# Altium schematic sheet AUDIO.SchDoc
size 558 x 431 mm
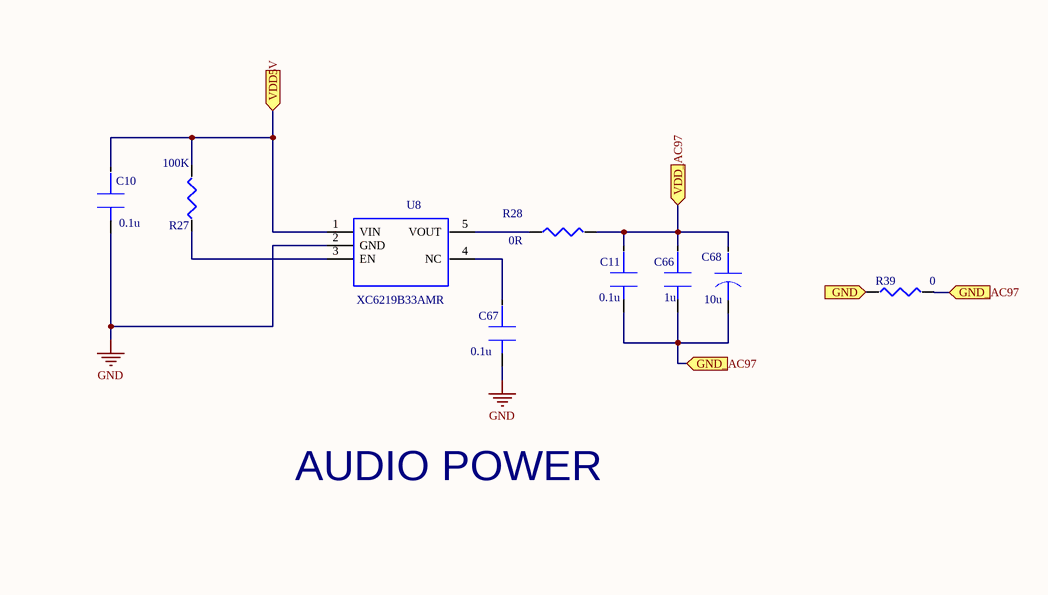
[diagram p0: AUDIO.SchDoc, top left]
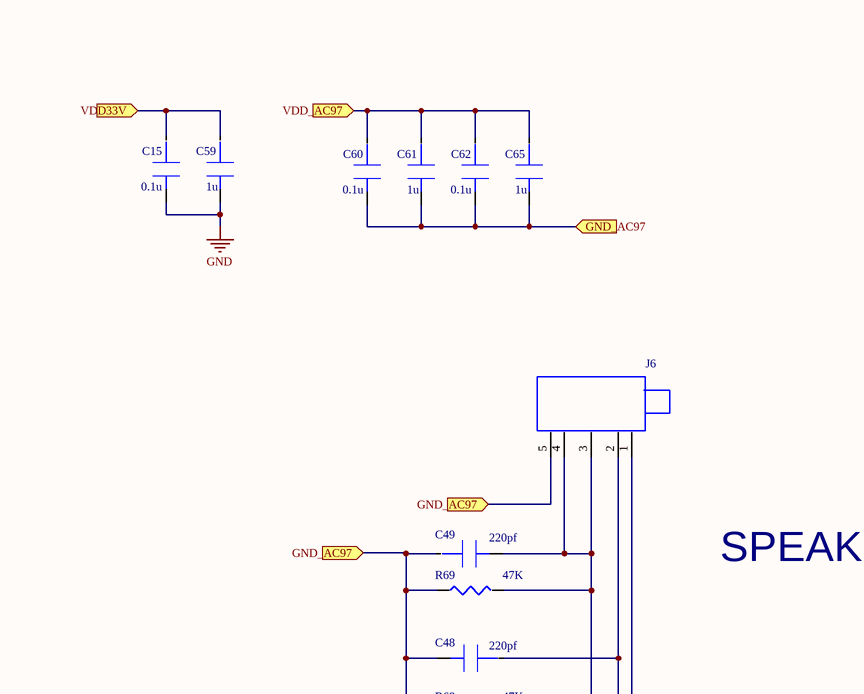
[diagram p1: AUDIO.SchDoc, top right]
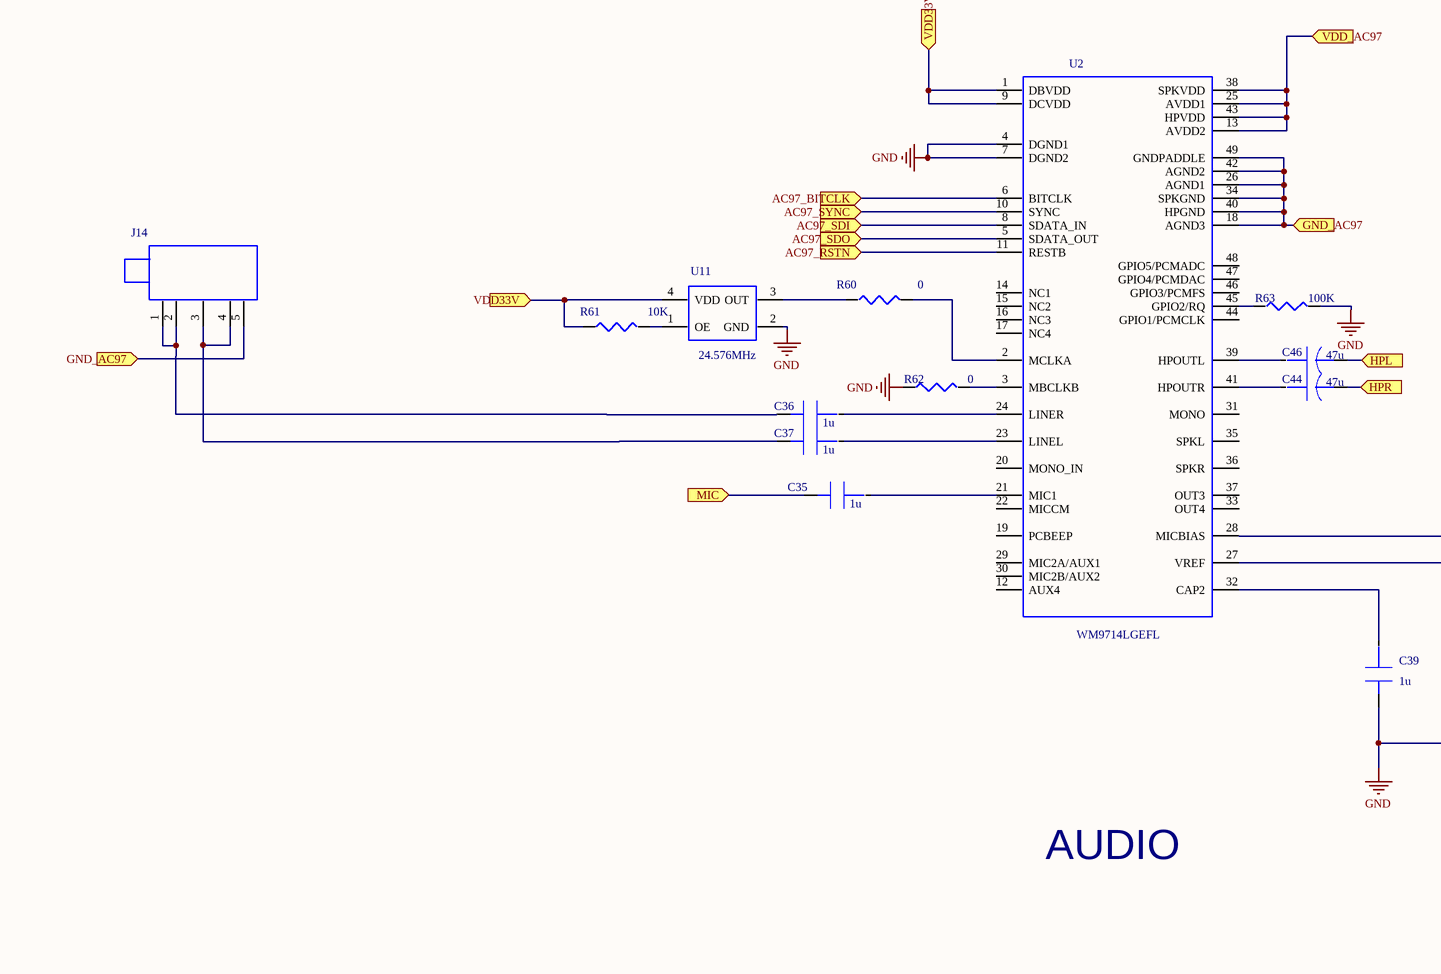
[diagram p2: AUDIO.SchDoc, bottom left]
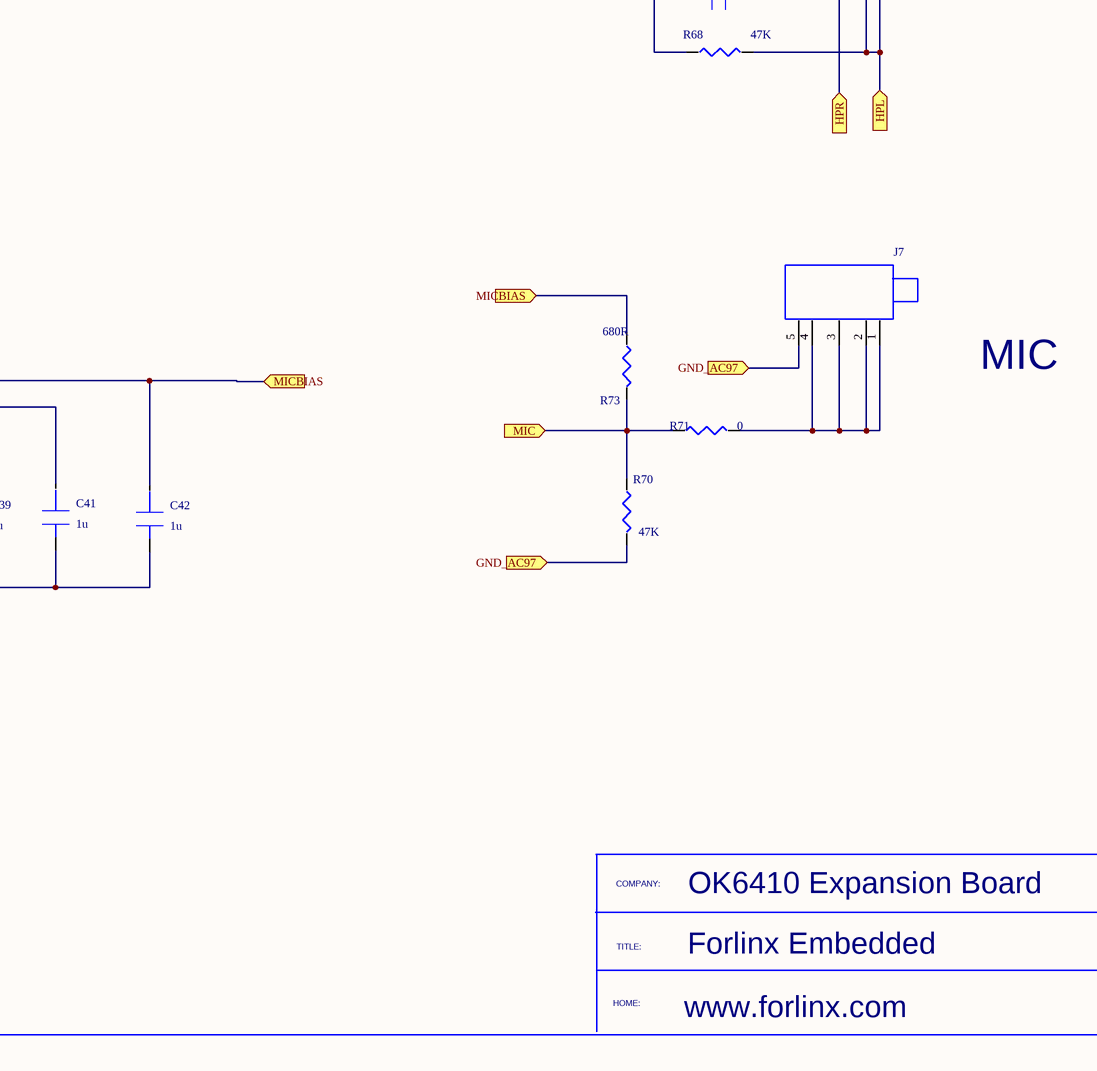
[diagram p3: AUDIO.SchDoc, bottom right]

## Parts
C10  value 0.1u  (hidden comment: CAP1206)
C11  value 0.1u  (hidden comment: CAP1206)
C15  value 0.1u  (hidden comment: CAP1206)
C35  value 1u  (hidden comment: CAP1206)
C36  value 1u  (hidden comment: CAP1206)
C37  value 1u  (hidden comment: CAP1206)
C39  value 1u  (hidden comment: CAP1206)
C41  value 1u  (hidden comment: CAP1206)
C42  value 1u  (hidden comment: CAP1206)
C44  value 47u  (hidden comment: CAP-AE4)
C46  value 47u  (hidden comment: CAP-AE4)
C48  value 220pf  (hidden comment: CAP1206)
C49  value 220pf  (hidden comment: CAP1206)
C59  value 1u  (hidden comment: CAP1206)
C60  value 0.1u  (hidden comment: CAP1206)
C61  value 1u  (hidden comment: CAP1206)
C62  value 0.1u  (hidden comment: CAP1206)
C65  value 1u  (hidden comment: CAP1206)
C66  value 1u  (hidden comment: CAP1206)
C67  value 0.1u  (hidden comment: CAP1206)
C68  value 10u  (hidden comment: CAP-AE4)
J6  MIC_SPEAKER  (value not drawn)
J7  MIC_SPEAKER  (value not drawn)
J14  MIC_SPEAKER  (value not drawn)
R27  value 100K  (hidden comment: R_0)
R28  value 0R  (hidden comment: R_0)
R39  value 0  (hidden comment: R)
R60  value 0  (hidden comment: R)
R61  value 10K  (hidden comment: R)
R62  value 0  (hidden comment: R)
R63  value 100K  (hidden comment: R)
R68  value 47K  (hidden comment: R)
R69  value 47K  (hidden comment: R)
R70  value 47K  (hidden comment: R)
R71  value 0  (hidden comment: R)
R73  value 680R  (hidden comment: R)
U2  WM9714LGEFL
U8  XC6219B33AMR
U11  value 24.576MHz  (hidden comment: Y7050)

## Ports
AC97_BITCLK, AC97_RSTN, AC97_SDI, AC97_SDO, AC97_SYNC, GND, GND_AC97, HPL, HPR, MIC, MICBIAS, VDD5V, VDD33V, VDD_AC97

## Nets
GND: C10.2 C15.2 C39.2 C41.2 C42.2 C59.2 C67.2 R62.1 R63.2 U2.4(DGND1) U2.7(DGND2) U8.2(GND) U11.2(GND)
AC97_BITCLK: U2.6(BITCLK) ; port AC97_BITCLK
AC97_RSTN: U2.11(RESTB) ; port AC97_RSTN
AC97_SDI: U2.8(SDATA_IN) ; port AC97_SDI
AC97_SDO: U2.5(SDATA_OUT) ; port AC97_SDO
AC97_SYNC: U2.10(SYNC) ; port AC97_SYNC
GND: R39.1 ; port GND  [a separate net that carries the same name]
GND_AC97: C11.2 C48.2 C49.1 C60.2 C61.2 C62.2 C65.2 C66.2 C68.2 J6.5 J7.5 J14.5 R39.2 R68.1 R69.1 R70.2 U2.18(AGND3) U2.26(AGND1) U2.34(SPKGND) U2.40(HPGND) U2.42(AGND2) U2.49(GNDPADDLE) ; port GND_AC97
HPL: C46.2 C48.1 J6.1 J6.2 R68.2 ; port HPL
HPR: C44.2 C49.2 J6.3 J6.4 R69.2 ; port HPR
MIC: C35.2 R70.1 R71.1 R73.2 ; port MIC
MICBIAS: C42.1 R73.1 U2.28(MICBIAS) ; port MICBIAS
VDD5V: C10.1 R27.1 U8.1(VIN) ; port VDD5V
VDD33V: C15.1 C59.1 R61.1 U2.1(DBVDD) U2.9(DCVDD) U11.4(VDD) ; port VDD33V
VDD_AC97: C11.1 C60.1 C61.1 C62.1 C65.1 C66.1 C68.1 R28.1 U2.13(AVDD2) U2.25(AVDD1) U2.38(SPKVDD) U2.43(HPVDD) ; port VDD_AC97
NetC35_1: C35.1 U2.21(MIC1)
NetC36_1: C36.1 U2.24(LINER)
NetC36_2: C36.2 J14.1 J14.2
NetC37_1: C37.1 U2.23(LINEL)
NetC37_2: C37.2 J14.3 J14.4
NetC39_1: C39.1 U2.32(CAP2)
NetC41_1: C41.1 U2.27(VREF)
NetC44_1: C44.1 U2.41(HPOUTR)
NetC46_1: C46.1 U2.39(HPOUTL)
NetC67_1: C67.1 U8.4(NC)
NetJ7_1: J7.1 J7.2 J7.3 J7.4 R71.2
NetR27_2: R27.2 U8.3(EN)
NetR28_2: R28.2 U8.5(VOUT)
NetR60_1: R60.1 U11.3(OUT)
NetR60_2: R60.2 U2.2(MCLKA)
NetR61_2: R61.2 U11.1(OE)
NetR62_2: R62.2 U2.3(MBCLKB)
NetR63_1: R63.1 U2.45(GPIO2/RQ)

Not connected (* = marked no-connect by the designer): U2 12(AUX4) 14(NC1) 15(NC2) 16(NC3) 17(NC4) 19(PCBEEP) 20(MONO_IN) 22(MICCM) 29(MIC2A/AUX1) 30(MIC2B/AUX2) 31(MONO) 33(OUT4) 35(SPKL) 36(SPKR) 37(OUT3) 44(GPIO1/PCMCLK) 46(GPIO3/PCMFS) 47(GPIO4/PCMDAC) 48(GPIO5/PCMADC)

## Notes on the sheet
- AUDIO POWER
- SPEAKER
- MIC
- AUDIO
- COMPANY:
- OK6410 Expansion Board
- TITLE:
- Forlinx Embedded
- HOME:
- www.forlinx.com

## Library data of the parts
C10 C11 C15 C35-C37 C39 C41 C42 C48 C49 C59-C62 C65-C67 = CAP1206: SURFACE MOUNT CAPACITOR 0.062 X 0.126 INCHES; Manufacturer #1: IPC SM-782 STD.; PCB DECAL: 0603A
C44 C46 C68 = CAP-AE4: ALUMINUM ELECTROLYTIC CAP.; Manufacturer #1: IPC SM-782 STD.; PCB DECAL: 3216A
J6 J7 J14 = MIC_SPEAKER: PCB DECAL: PHONE1
R27 R28 = R_0: PCB Footprint: C2012; PCB DECAL: 0603A
R39 R60-R63 R68-R71 R73 = R: PCB DECAL: 0603A
U2 = WM9714LGEFL: PCB DECAL: QFN48
U8 = XC6219B33AMR: PCB DECAL: XC6218B
U11 = Y7050: PART DESC: PIN4 CRYSTAL; PCB DECAL: OSCLCC